# Altium project HORNET_MOTOR_CONTROLLER.PrjPcb (part 2 of 2)
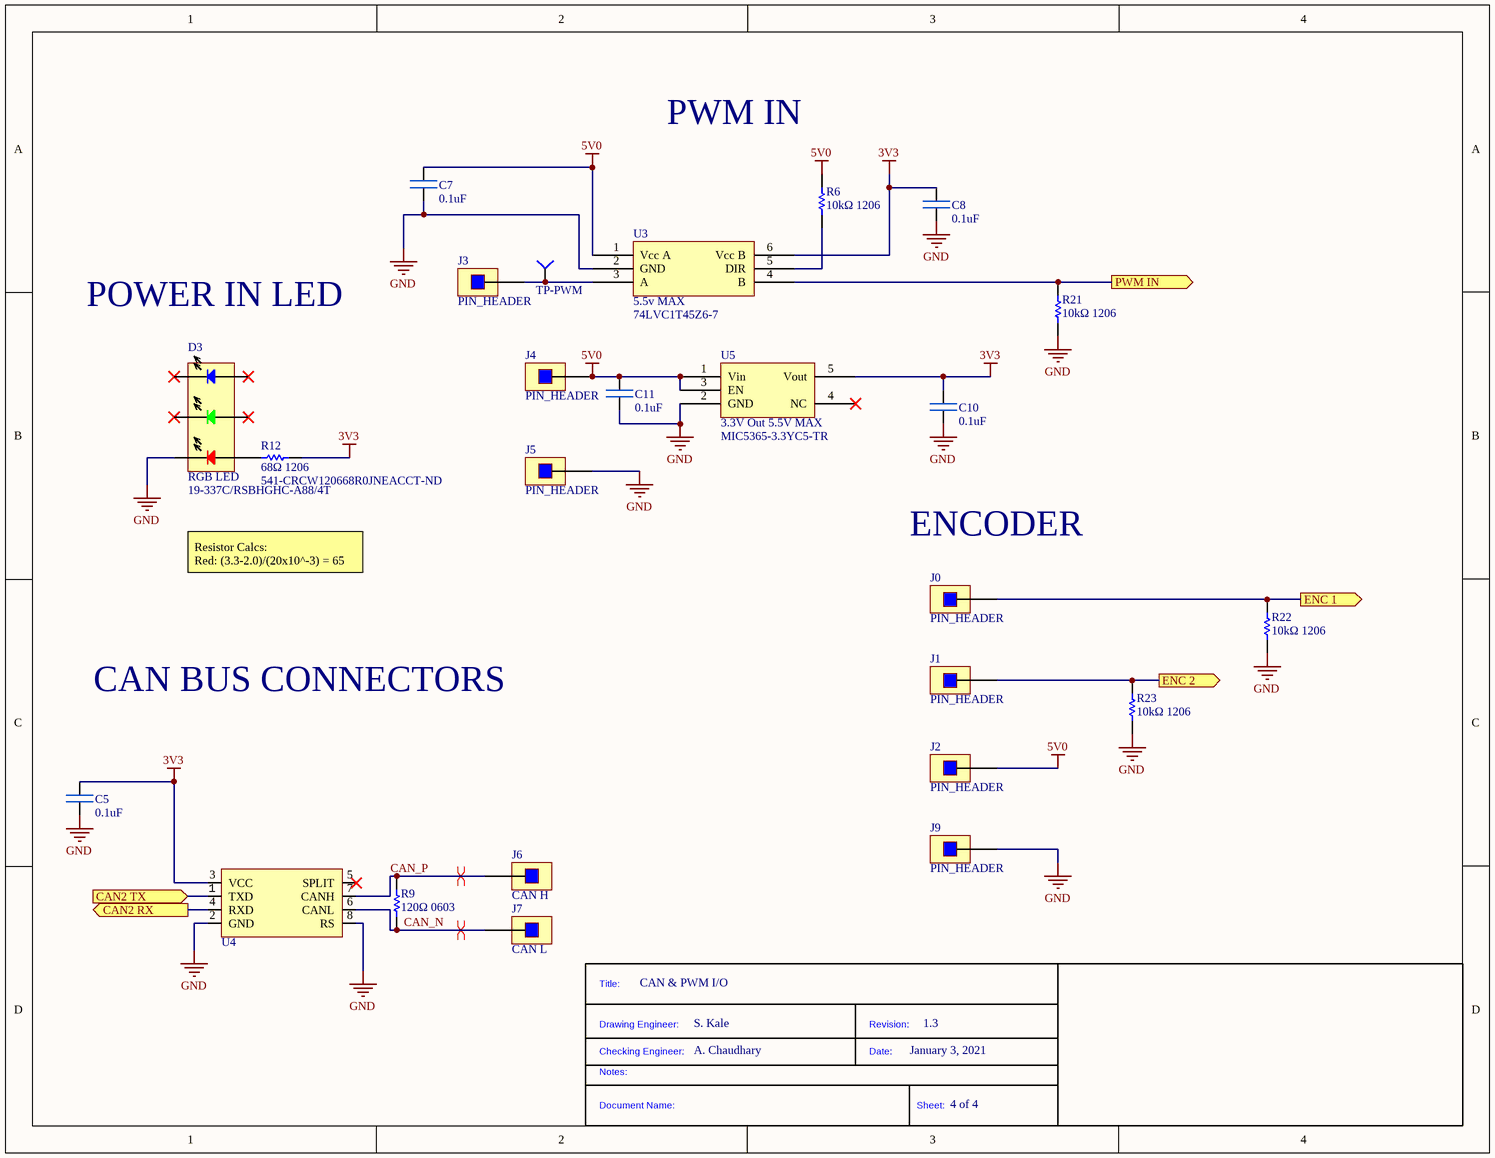
[diagram p4: SH4 - PWM + CAN.SchDoc]

## Nets that join several sheets
3V3: SH1 - STM32 (10 pins), SH3 - Debug Communication (5 pins), SH4 - PWM + CAN (7 pins)
5V0: SH2 - HBridge (U6.5), SH3 - Debug Communication (C6.1 J8.10 P1.1 U2.20), SH4 - PWM + CAN (8 pins)
GND: SH1 - STM32 (12 pins), SH2 - HBridge (12 pins), SH3 - Debug Communication (20 pins), SH4 - PWM + CAN (15 pins)
NetJ0_1: SH1 - STM32 (TP-E1.1 U1.8), SH4 - PWM + CAN (J0.1 R22.2)
NetJ1_1: SH1 - STM32 (TP-E2.1 U1.9), SH4 - PWM + CAN (J1.1 R23.2)
NetJ8_1: SH1 - STM32 (U1.7), SH3 - Debug Communication (J8.1 R18.1 S2.2)
NetJ8_2: SH1 - STM32 (U1.46), SH3 - Debug Communication (J8.2)
NetJ8_5: SH1 - STM32 (U1.50), SH3 - Debug Communication (J8.5)
NetJ8_6: SH1 - STM32 (U1.49), SH3 - Debug Communication (J8.6)
NetMODE_2: SH1 - STM32 (U1.40), SH3 - Debug Communication (MODE.2 R13.2)
NetQ1_1: SH1 - STM32 (U1.58), SH2 - HBridge (Q1.1 R7.2 TP-H1.1)
NetQ2_1: SH1 - STM32 (U1.59), SH2 - HBridge (Q2.1 R8.2 TP-H2.1)
NetQ3_1: SH1 - STM32 (U1.61), SH2 - HBridge (Q3.1 R14.2 TP-H3.1)
NetQ4_1: SH1 - STM32 (U1.62), SH2 - HBridge (Q4.1 R15.2 TP-H4.1)
NetQ5_1: SH1 - STM32 (U1.35), SH2 - HBridge (Q5.1 R16.2 TP-H5.1)
NetQ6_1: SH1 - STM32 (U1.36), SH2 - HBridge (Q6.1 R17.2 TP-H6.1)
NetQ7_1: SH1 - STM32 (U1.56), SH2 - HBridge (Q7.1 R19.2)
NetR10_2: SH1 - STM32 (U1.17), SH3 - Debug Communication (R10.2 TP-RX.1 U2.1)
NetR11_2: SH1 - STM32 (U1.16), SH3 - Debug Communication (R11.2 TP-TX.1 U2.5)
NetR21_2: SH1 - STM32 (U1.14 U1.15), SH4 - PWM + CAN (R21.2 U3.4)
NetTP-CRX_1: SH1 - STM32 (TP-CRX.1 U1.33), SH4 - PWM + CAN (U4.4)
NetTP-CTX_1: SH1 - STM32 (TP-CTX.1 U1.34), SH4 - PWM + CAN (U4.1)